# EAGLE design ATX_Power_Breakout_v1p3 (EAGLE 9.5.1)
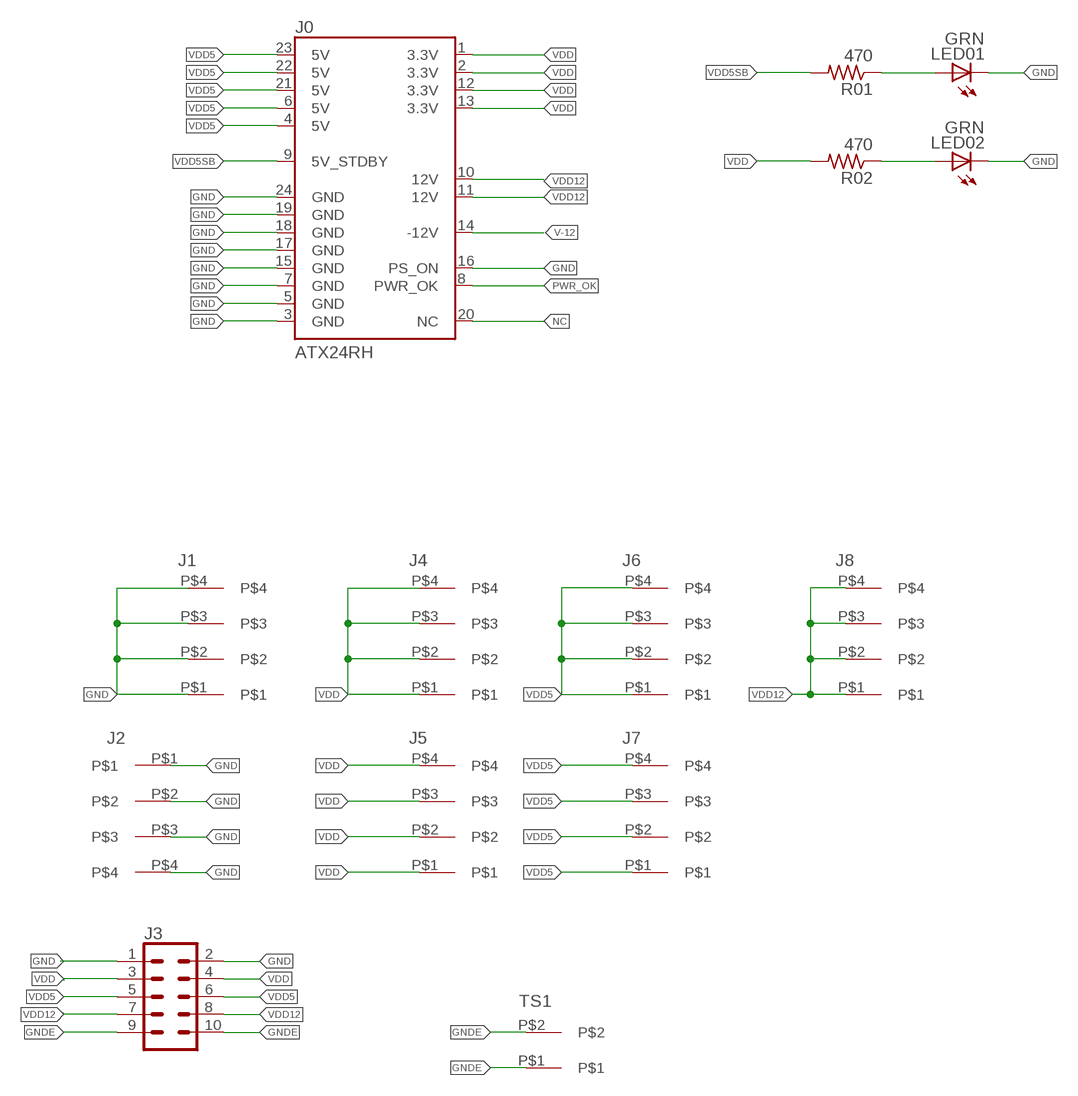
[diagram p0: schematic, sheet 1]

## Parts
J0  ATX24RH  [ATX24_RIGHT_ANGLE]
J1  3.81MM_1_X_4_RT_ANGLE_PLUG_HEADER  [1X4_3.81MM_PITCH]
J2  3.81MM_1_X_4_RT_ANGLE_PLUG_HEADER  [1X4_3.81MM_PITCH]
J3  CONN_05X2PTH  [2X5]
J4  3.81MM_1_X_4_RT_ANGLE_PLUG_HEADER  [1X4_3.81MM_PITCH]
J5  3.81MM_1_X_4_RT_ANGLE_PLUG_HEADER  [1X4_3.81MM_PITCH]
J6  3.81MM_1_X_4_RT_ANGLE_PLUG_HEADER  [1X4_3.81MM_PITCH]
J7  3.81MM_1_X_4_RT_ANGLE_PLUG_HEADER  [1X4_3.81MM_PITCH]
J8  3.81MM_1_X_4_RT_ANGLE_PLUG_HEADER  [1X4_3.81MM_PITCH]
LED01  GREEN  LED_0805_GREEN  [LED_0805_GREEN]
LED02  GREEN  LED_0805_GREEN  [LED_0805_GREEN]
R01  470  R_0402  [0402]
R02  470  R_0402  [0402]
TS1  3.81MM_1_X_2_RT_ANGLE_PLUG_HEADER  [1X2_3.81MM_PITCH]

## Nets
GND: J0.3(GND) J0.5(GND) J0.7(GND) J0.15(GND) J0.16(PS_ON) J0.17(GND) J0.18(GND) J0.19(GND) J0.24(GND) J1.P$1 J1.P$2 J1.P$3 J1.P$4 J2.P$1 J2.P$2 J2.P$3 J2.P$4 J3.1 J3.2 LED01.C LED02.C
GNDE: J3.9 J3.10 TS1.P$1 TS1.P$2
N$4: LED01.A R01.P$1
N$5: LED02.A R02.P$1
NC: J0.20(NC)
PWR_OK: J0.8(PWR_OK)
V-12: J0.14(-12V)
VDD: J0.1(3.3V) J0.2(3.3V) J0.12(3.3V) J0.13(3.3V) J3.3 J3.4 J4.P$1 J4.P$2 J4.P$3 J4.P$4 J5.P$1 J5.P$2 J5.P$3 J5.P$4 R02.P$2
VDD5: J0.4(5V) J0.6(5V) J0.21(5V) J0.22(5V) J0.23(5V) J3.5 J3.6 J6.P$1 J6.P$2 J6.P$3 J6.P$4 J7.P$1 J7.P$2 J7.P$3 J7.P$4
VDD5SB: J0.9(5V_STDBY) R01.P$2
VDD12: J0.10(12V) J0.11(12V) J3.7 J3.8 J8.P$1 J8.P$2 J8.P$3 J8.P$4

## Library data of the parts
J0 = 3D_MIG_Controller:ATX24: ATX24 Pin Power Supply Connector - Right Angle PTH Mount This is a good connector for connecting a computer power supply to a PCB. It's massive, but provides many amps of power at 5V and 12V. SparkFun Products: SparkFun Benchtop Power Board Kit <https://www.sparkfun.com/products/12867> SparkFun Power Driver Shield Kit <https://www.sparkfun.com/products/10618>; PROD_ID: CONN-09674; SF_ID: PRT-09498
J1 J2 J4-J8 = 3D_MIG_Controller:3.81MM_1_X_4_RT_ANGLE_PLUG_HEADER
J3 = 3D_MIG_Controller:CONN_05X2: Multi connection point. Often used as Generic Header-pin footprint for 0.1 inch spaced/style header connections For AVR SPI programming port, see special device with nice symbol: "AVR_SPI_PROG_5x2.dev" You can populate with any combo of single row headers, but if you'd like an exact match, check these: 2x5 AVR ICSP Male Header <https://www.sparkfun.com/products/778> (PRT-00778) 2x5 Pin Shrouded Header <https://www.sparkfun.com/products/8506> (PRT-08506) On any of the 0.1 inch spaced packages, you can populate with these: Break Away Headers - Straight <https://www.sparkfun.com/products/116> (PRT-00116) Break Away Male Headers - Right Angle <https://www.sparkfun.com/products/553> (PRT-00553) Female Headers <https://www.sparkfun.com/products/115> (PRT-00115) Break Away Headers - Machine Pin <https://www.sparkfun.com/products/117> (PRT-00117) Break Away Female Headers - Swiss Machine Pin <https://www.sparkfun.com/products/743> (PRT-00743) Special note: the shrouded connector mates well with our 5x2 ribbon cables: 2x5 Pin IDC Ribbon Cable <https://www.sparkfun.com/products/8535> (PRT-08535); PROD_ID: CONN-08499; SF_ID: PRT-0778
LED01 LED02 = 3D_MIG_Controller:LED_0805_GREEN
R01 R02 = 3D_MIG_Controller:R_0402
TS1 = 3D_MIG_Controller:3.81MM_1_X_2_RT_ANGLE_PLUG_HEADER

## Board
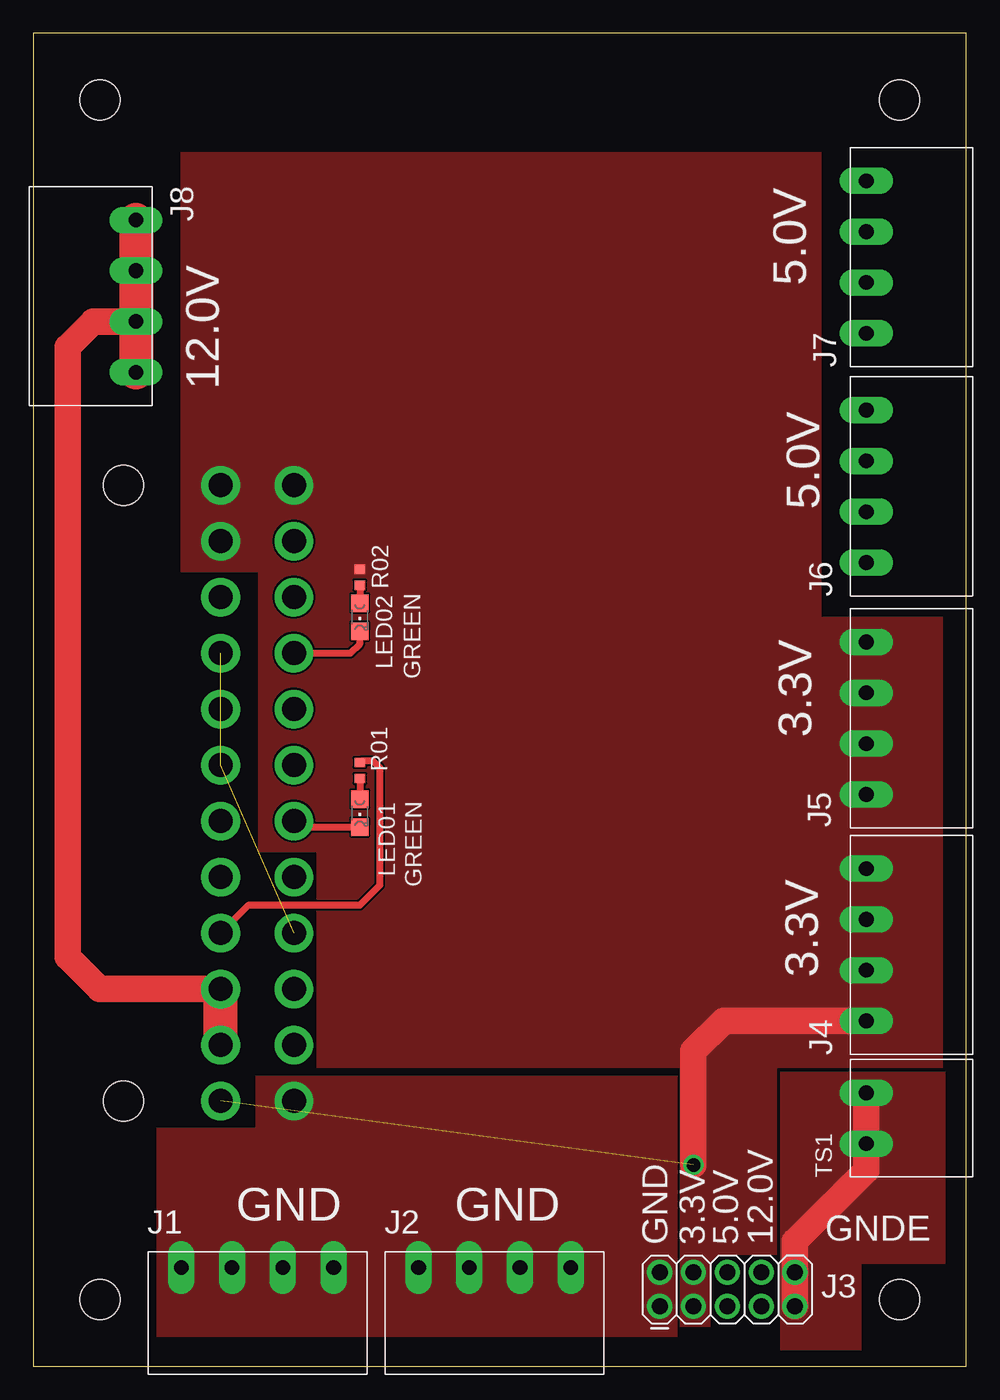
[diagram p1: board, top side]
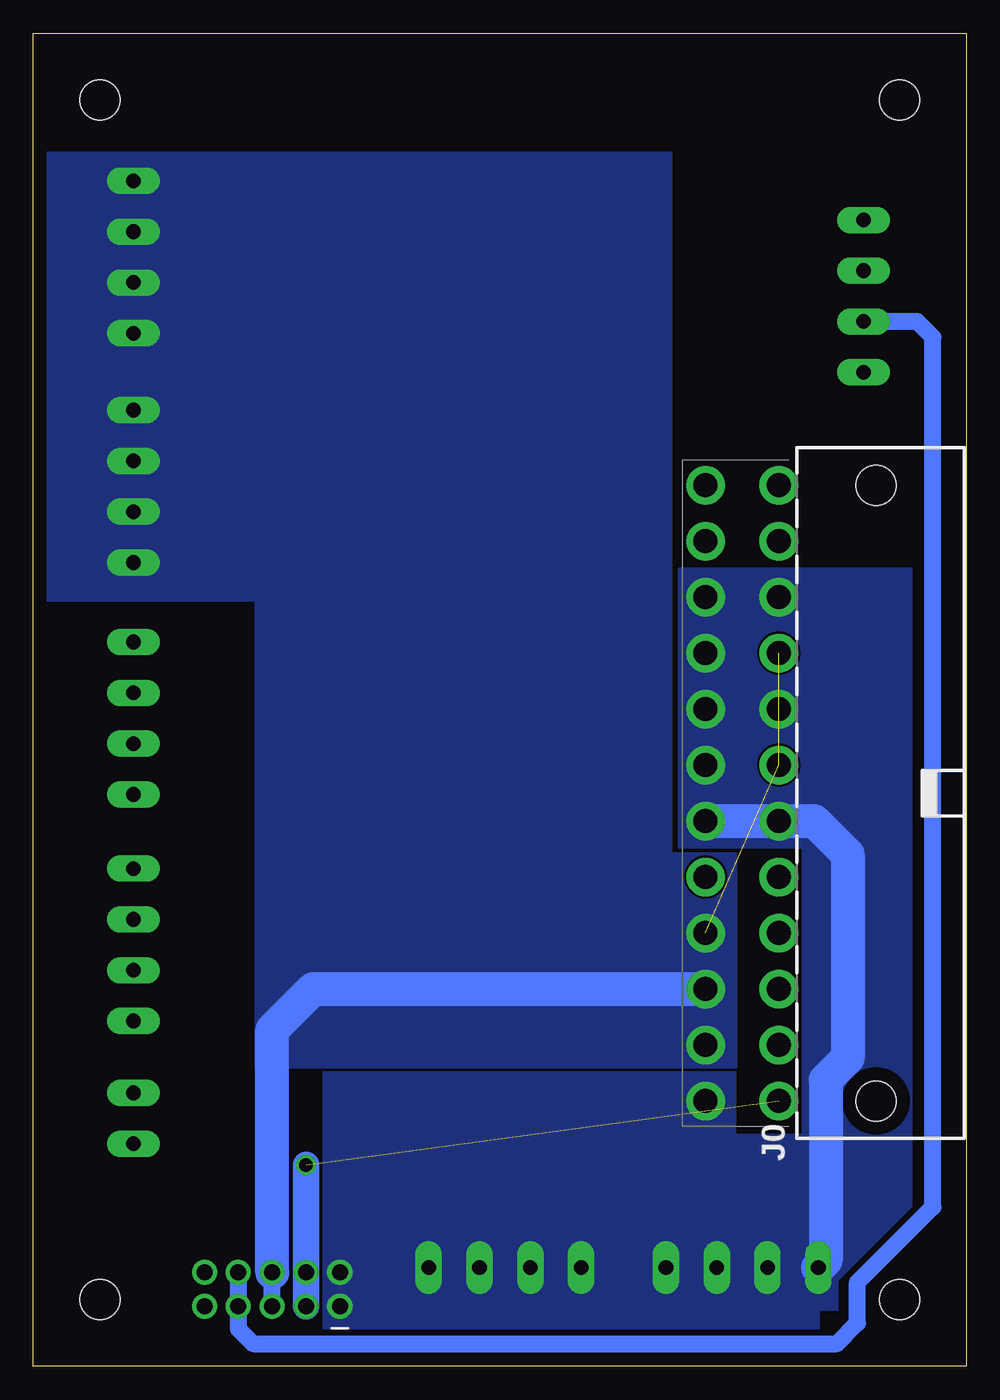
[diagram p2: board, bottom side, seen from below]

Size 70 x 100 mm. Coordinates in mm from the lower left corner, seen from the top.
Outline: 0,0 70,0 70,100 0,100 0,0
Copper layers (1*16): Top 0.035mm / dielectric 1.5mm / Bottom 0.035mm
Design rules "default": minimum track width 6mil, minimum drill 0.35mm, track to track 6mil, track to pad 6mil, pad to pad 6mil, via to via 6mil, smd to smd 6mil, copper to edge 40mil, drill to drill 6mil, minimum pad ring 10mil, minimum via ring 8mil, stop-mask expansion 4mil, vias tented up to drill 0mil, thermal gap 10mil
Holes 3 mm at 5,95 5,5 65,5 65,95

### Footprints (pad centres in the part's own frame; a part is rotated, then mirrored left to right if it is on the bottom)
ATX24_RIGHT_ANGLE = drill 1.8 pad 2.9: 1 23.1,4.76; 2 18.9,4.76; 3 14.7,4.76; 4 10.5,4.76; 5 6.3,4.76; 6 2.1,4.76; 7 -2.1,4.76; 8 -6.3,4.76; 9 -10.5,4.76; 10 -14.7,4.76; 11 -18.9,4.76; 12 -23.1,4.76; 13 23.1,10.26; 14 18.9,10.26; 15 14.7,10.26; 16 10.5,10.26; 17 6.3,10.26; 18 2.1,10.26; 19 -2.1,10.26; 20 -6.3,10.26; 21 -10.5,10.26; 22 -14.7,10.26; 23 -18.9,10.26; 24 -23.1,10.26 | hole 3: -23.1,-2.54; 23.1,-2.54
1X4_3.81MM_PITCH = drill 1.1 pad 2 long: P$1 0,0; P$2 3.81,0; P$3 7.62,0; P$4 11.43,0
2X5 = drill 1.2 pad 1.88: 1 0,0; 2 0,2.54; 3 2.54,0; 4 2.54,2.54; 5 5.08,0; 6 5.08,2.54; 7 7.62,0; 8 7.62,2.54; 9 10.16,0; 10 10.16,2.54
LED_0805_GREEN = smd 1.3 x 1.3: A 0,-1.05; C 0,1.05
0402 = smd 0.8 x 0.7: P$1 0,0.6; P$2 0,-0.6
1X2_3.81MM_PITCH = drill 1.1 pad 2 long: P$1 0,0; P$2 3.81,0

### Placement (x,y rotation side)
J0  9.3,43 90 bottom
J1  11.1,7.4 0 top
J2  28.9,7.4 0 top
J3  47,4.5 0 top
J4  62.5,25.9 90 top
J5  62.5,42.9 90 top
J6  62.5,60.3 90 top
J7  62.5,77.5 90 top
J8  7.7,86 270 top
LED01  24.5,41.5 180 top
LED02  24.5,56.2 180 top
R01  24.5,44.7 180 top
R02  24.5,59.2 180 top
TS1  62.5,16.7 90 top

### Tracks (layer width: path | path; a pad name or v marks a point on that pad's centre or on a via)
GND
  Top 0.508: J0.19 20.01,40.45 LED01.C | J0.16 23.8,53.5 24.5,54.2 LED02.C
  Bottom 2.54: J0.19 J0.7 11.4,40.9 8.9,38.4 8.9,23.11 10.55,21.47 10.55,7.95 J1.P$1
  pour Bottom (no thermals): 9.6,4.2 9.6,17.4 17.3,17.4 17.3,22.1 48.3,22.1 48.3,2.8 11,2.8 11,4.2
  pour Bottom (no thermals): 21.6,38.9 21.6,59.9 4.1,59.9 4.1,12 9.8,6.3 12.3,6.3 12.3,38.9
  pour Top (no thermals): 48.3,2.2 9.3,2.2 9.3,17.9 16.7,17.9 16.7,21.8 48.3,21.8
GNDE
  Top 2: J3.9 J3.10 57.16,9.36 62.5,14.7 TS1.P$1 TS1.P$2
  pour Top (no thermals): 56.1,1.2 56.1,22.1 68.4,22.1 68.4,7.7 62.1,7.7 62.1,1.2
N$4
  Top 0.508: R01.P$1 LED01.A
N$5
  Top 0.508: R02.P$1 LED02.A
VDD  (via drill 1)  (1 unrouted)
  Top 2: v49.54,15.1 49.54,23.64 51.8,25.9 J4.P$1
  Bottom 2: v49.54,15.1 J3.4 J3.3
  pour Top (no thermals): 68.2,22.4 21.3,22.4 21.3,38.6 16.9,38.6 16.9,59.6 11.1,59.6 11.1,91.1 59.1,91.1 59.1,56.2 68.2,56.2
  pour Top (no thermals): 50.8,3 50.8,7.7 51.5,8.4 55.8,8.4 55.8,22.8 48.5,22.8 48.5,3
VDD5  (2 unrouted)
  Bottom 1.27: J3.5 J3.6
  Bottom 2.54: J3.6 52.08,25.22 49,28.3 J0.22
  pour Bottom (no thermals): 22.1,91.1 70,91.1 70,57.4 53.4,57.4 53.4,22.4 17.2,22.4 17.2,38.5 22.1,38.5
VDD5SB
  Top 0.508: J0.9 16.16,34.6 24.5,34.6 26,36.1 26,44.9 25.5,45.4 24.6,45.4 R01.P$2
VDD12
  Top 2: J0.10 5,28.3 2.59,30.71 2.59,76.47 4.5,78.38 J8.P$3
  Top 2.54: J0.11 J0.10 | J8.P$1 J8.P$2 J8.P$3 J8.P$4
  Bottom 1.27: J3.8 J3.7 54.62,2.8 53.52,1.7 9.7,1.7 8.15,3.25 8.15,6.3 2.5,11.96 2.5,77.2 3.68,78.38 J8.P$3

### Text on the board
tNames: 12.0V | 5.0V | 5.0V | 3.3V | 3.3V | GND | GND | GND | 3.3V | 5.0V | 12.0V | GNDE